# Altium schematic sheet Analogue Channel.SchDoc
size A4
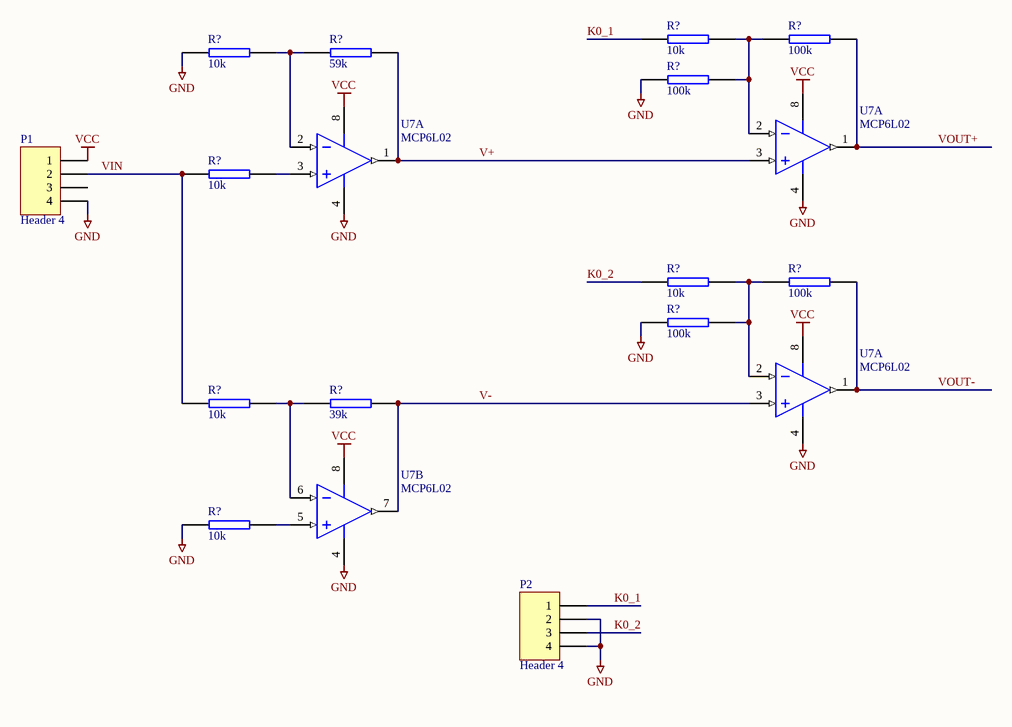
[diagram p0: Analogue Channel.SchDoc]

## Parts
(Parts that share a designator on the sheet are numbered #1, #2 ... from top to bottom, then left to right.)
P1  Header 4  [HDR1X4]
P2  Header 4  [HDR1X4]
R?#1  10k  [RES(3D) - 0603]
R?#2  100k  [RES(3D) - 0603]
R?#3  10k  [RES(3D) - 0603]
R?#4  59k  [RES(3D) - 0603]
R?#5  100k  [RES(3D) - 0603]
R?#6  10k  [RES(3D) - 0603]
R?#7  10k  [RES(3D) - 0603]
R?#8  100k  [RES(3D) - 0603]
R?#9  100k  [RES(3D) - 0603]
R?#10  10k  [RES(3D) - 0603]
R?#11  39k  [RES(3D) - 0603]
R?#12  10k  [RES(3D) - 0603]
U7#1  MCP6L02  [SO-8]  (part A of 2)
U7#2  MCP6L02  [SO-8]  (parts A,B of 2)
U7#3  MCP6L02  [SO-8]  (part A of 2)

## Nets
GND: P1.4 P2.2 P2.4 R?#3.1 R?#5.1 R?#9.1 R?#12.1 U7#1.4(GND) U7#2.4(GND) U7#3.4(GND)
VCC: P1.1 U7#1.8(V+) U7#2.8(V+) U7#3.8(V+)
K0_1: P2.1 R?#1.1
K0_2: P2.3 R?#7.1
V+: R?#4.2 U7#1.3(INA+) U7#2.1(OUTA)
V-: R?#11.2 U7#2.7(OUTB) U7#3.3(INA+)
VIN: P1.2 R?#6.1 R?#10.1
VOUT+: R?#2.2 U7#1.1(OUTA)
VOUT-: R?#8.2 U7#3.1(OUTA)
NetR?#1_2: R?#1.2 R?#2.1 R?#5.2 U7#1.2(INA-)
NetR?#3_2: R?#3.2 R?#4.1 U7#2.2(INA-)
NetR?#6_2: R?#6.2 U7#2.3(INA+)
NetR?#7_2: R?#7.2 R?#8.1 R?#9.2 U7#3.2(INA-)
NetR?#10_2: R?#10.2 R?#11.1 U7#2.6(INB-)
NetR?#12_2: R?#12.2 U7#2.5(INB+)

Not connected (* = marked no-connect by the designer): P1 3

## Library data of the parts
P1 P2 = Header 4: Header, 4-Pin; LatestRevisionDate: 17-Jul-2002; LatestRevisionNote: Re-released for DXP Platform.; Publisher: Altium Limited
R?#1 R?#3 R?#6 R?#7 R?#10 R?#12 = RES SMD 0603 10k: RESISTOR SMD 0603 10k; Manufacturer: Bourns; Manufacturer Part No.: CR0603FX-1002ELF; Mouser Part no.: 652-CR0603FX-1002ELF; Web link: http://au.mouser.com/Search/Refine.aspx?Keyword=652-CR0603FX-1002ELF; value: 10k
R?#2 R?#4 R?#5 R?#8 R?#9 = RES SMD 0603 39k: RESISTOR SMD 0603 39k; Manufacturer: Bourns
  R?#2 R?#5 R?#8 R?#9: value: 100k
  R?#4: value: 59k
R?#11 = RES SMD 0603 39k: RESISTOR SMD 0603 39k; Manufacturer: Bourns; Manufacturer Part No.: CR0603-FX-3902ELF; Mouser Part no.: 652-CR0603FX-3902ELF; Web link: http://au.mouser.com/ProductDetail/Bourns/CR0603-FX-3902ELF/?qs=sGAEpiMZZMukHu%252bjC5l7YStVON7zpqsW55hf5FaCutw%3d; value: 39k
U7#1-U7#3 = MCP6L02: Value: MCP6L02